# Altium schematic sheet Memory.SchDoc: Memory
size A; Author: Alexander Curtiss; DocumentNumber: 5; SheetNumber: 5; SheetTotal: 6
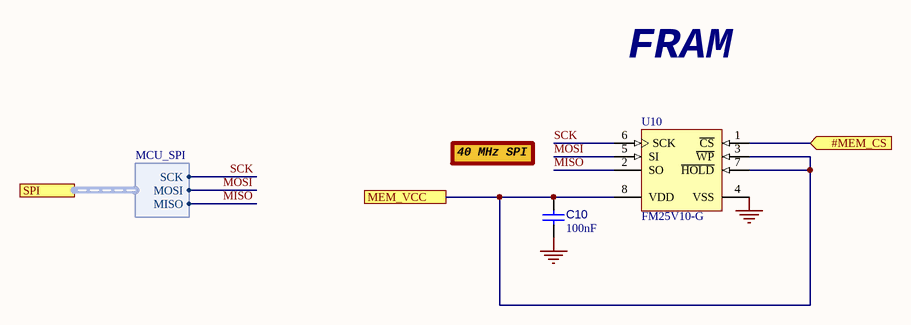
[diagram p0: Memory.SchDoc]

## Parts
C10  value 100nF  [CAPC0402(1005)60_L]  (hidden comment: Capacitor 100nF +/-20% 25V 0402)
U10  FM25V10-G  [SOIC127P600X173-8N]

## Ports
#MEM_CS (in), MEM_VCC, SPI (harness MCU_SPI)

## Harnesses
MCU_SPI: MISO, MOSI, SCK

## Nets
GND: C10.2 U10.4(VSS)
#MEM_CS: U10.1(~{CS}) ; port #MEM_CS
MEM_VCC: C10.1 U10.3(~{WP}) U10.7(~{HOLD}) U10.8(VDD) ; port MEM_VCC
MISO: U10.2(SO) ; port SPI.MISO
MOSI: U10.5(SI) ; port SPI.MOSI
SCK: U10.6(SCK) ; port SPI.SCK

## Notes on the sheet
- FRAM
- (near C10) 40 MHz SPI
- Title:
- Sheet
- of
- Project:
- Author:
- Date:
- Variant:
- Ka Moamoa
- Northwestern University
- http://kamoamoa.eecs.northwestern.edu/
- E-Mail:

## Library data of the parts
C10 = CMP-001-00065-2: Chip Capacitor, 100nF +/-20%, 25V, 0402, Thickness 0.6 mm; Tolerance: 10%; Pins: 2; Min Operating Temperature: -55°C; Max Operating Temperature: 85°C; Mounting Technology: SMT; Case/Package: 0603; Voltage Rating: 25V
U10 = CMP-00002-2: 1-Mbit Serial F-RAM, 2 to 3.6 V, -40 to 85 degC, 8-Pin SOIC (S08.15), RoHS, Tube; Memory Size: 1 Mbits; Supply Voltage Min: 2 V; Access Time: 18 ns; Supply Voltage Max: 3.6 V; Packing: Tube; Code_JEDEC: MS-012; ComponentLink1Description: Manufacturer URL; ComponentLink2URL: http://www.cypress.com/file/41691/download; ComponentLink3Description: Package Specification; PackageDescription: 8-Pin SOIC, Body 4.9 x 3.9 mm, Pitch 1.27 mm; ComponentLink3URL: http://www.mill-max.com/assets/pdfs/metric/007M.PDF; Temperature Min: -40 degC; DatasheetVersion: Rev. *F; Temperature Max: 85 degC; ComponentLink2Description: Datasheet; ComponentLink1URL: http://www.cypress.com/; PartNumber: FM25V10-G; Mounting Technology: Surface Mount; PackageVersion: Rev. *D, 12/2009; Generic Part Number: FM25V10; RoHS: TRUE